# EAGLE design nadajnik (EAGLE 6.4)
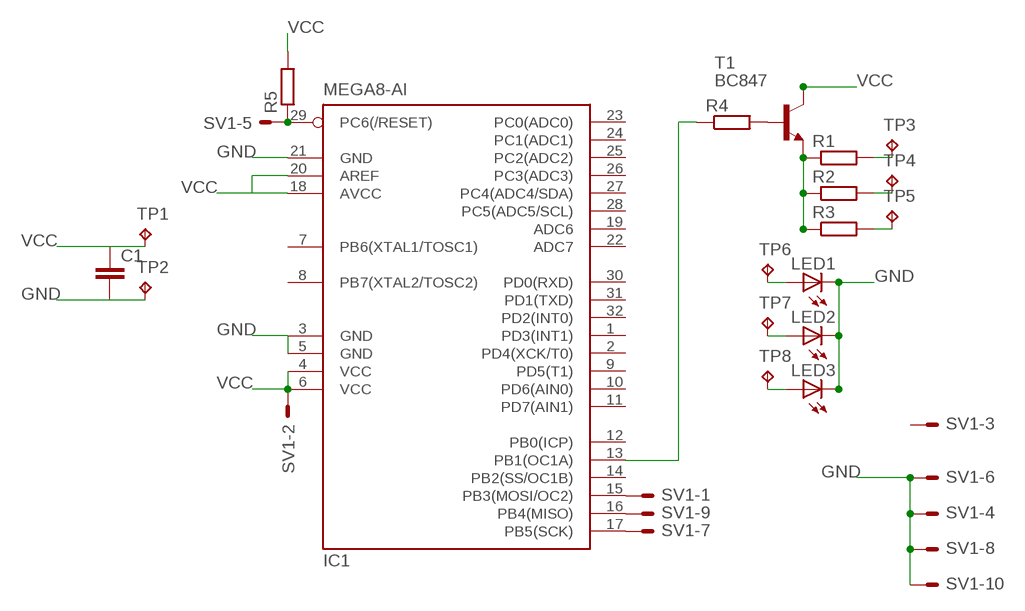
[diagram p0: schematic, sheet 1]

## Parts
C1  C-EUC1206  [C1206]
IC1  MEGA8-AI  [TQFP32-08]
LED1  LEDSFH480  [SFH480]
LED2  LEDSFH480  [SFH480]
LED3  LEDSFH480  [SFH480]
R1  R-EU_R1206  [R1206]
R2  R-EU_R1206  [R1206]
R3  R-EU_R1206  [R1206]
R4  R-EU_R1206  [R1206]
R5  R-EU_R1206  [R1206]
SV1  ML10E  [ML10]
T1  BC847  [SOT23]
TP1  TPPAD1-13Y  [P1-13Y]
TP2  TPPAD1-13Y  [P1-13Y]
TP3  TPPAD1-13Y  [P1-13Y]
TP4  TPPAD1-13Y  [P1-13Y]
TP5  TPPAD1-13Y  [P1-13Y]
TP6  TPPAD1-13Y  [P1-13Y]
TP7  TPPAD1-13Y  [P1-13Y]
TP8  TPPAD1-13Y  [P1-13Y]

## Nets
GND: C1.2 IC1.3(GND) IC1.5(GND) IC1.21(GND) LED1.K(C) LED2.K(C) LED3.K(C) SV1.4 SV1.6 SV1.8 SV1.10 TP2.TP
N$1: R1.2 TP3.TP
N$2: R2.2 TP4.TP
N$3: R3.2 TP5.TP
N$4: IC1.13(PB1(OC1A)) R4.1
N$5: R4.2 T1.1(B)
N$6: R1.1 R2.1 R3.1 T1.2(E)
N$7: LED1.A TP6.TP
N$8: LED2.A TP7.TP
N$9: LED3.A TP8.TP
N$10: IC1.15(PB3(MOSI/OC2)) SV1.1
N$11: IC1.29(PC6(/RESET)) R5.1 SV1.5
N$13: IC1.16(PB4(MISO)) SV1.9
N$14: IC1.17(PB5(SCK)) SV1.7
VCC: C1.1 IC1.4(VCC) IC1.6(VCC) IC1.18(AVCC) IC1.20(AREF) R5.2 SV1.2 T1.3(C) TP1.TP
Unconnected: IC1.1(PD3(INT1)) IC1.2(PD4(XCK/T0)) IC1.7(PB6(XTAL1/TOSC1)) IC1.8(PB7(XTAL2/TOSC2)) IC1.9(PD5(T1)) IC1.10(PD6(AIN0)) IC1.11(PD7(AIN1)) IC1.12(PB0(ICP)) IC1.14(PB2(SS/OC1B)) IC1.19(ADC6) IC1.22(ADC7) IC1.23(PC0(ADC0)) IC1.24(PC1(ADC1)) IC1.25(PC2(ADC2)) IC1.26(PC3(ADC3)) IC1.27(PC4(ADC4/SDA)) IC1.28(PC5(ADC5/SCL)) IC1.30(PD0(RXD)) IC1.31(PD1(TXD)) IC1.32(PD2(INT0)) SV1.3

## Library data of the parts
C1 = rcl:C-EU: CAPACITOR, European symbol
IC1 = atmel:MEGA8: MICROCONTROLLER 8 Kbytes FLASH, 1 kbytes SRAM, 512 bytes EEPROM, USART, 6-channel 10 bit ADC, 2-channel 8 bit ADC Pin compatible with Atmega48, ATMega88, ATMega168 Source: avr.lbr; MPN: ATMEGA8-16AU; OC_FARNELL: 9171371; OC_NEWARK: 73M8863
LED1-LED3 = led:LED: LED OSRAM: - CHIPLED LG R971, LG N971, LY N971, LG Q971, LY Q971, LO R971, LY R971 LH N974, LH R974 LS Q976, LO Q976, LY Q976 LO Q996 - Hyper CHIPLED LW Q18S LB Q993, LB Q99A, LB R99A - SideLED LS A670, LO A670, LY A670, LG A670, LP A670 LB A673, LV A673, LT A673, LW A673 LH A674 LY A675 LS A676, LA A676, LO A676, LY A676, LW A676 LS A679, LY A679, LG A679 - Hyper Micro SIDELED® LS Y876, LA Y876, LO Y876, LY Y876 LT Y87S - SmartLED LW L88C, LW L88S LB L89C, LB L89S, LG L890 LS L89K, LO L89K, LY L89K LS L896, LA L896, LO L896, LY L896 - TOPLED LS T670, LO T670, LY T670, LG T670, LP T670 LSG T670, LSP T670, LSY T670, LOP T670, LYG T670 LG T671, LOG T671, LSG T671 LB T673, LV T673, LT T673, LW T673 LH T674 LS T676, LA T676, LO T676, LY T676, LB T676, LH T676, LSB T676, LW T676 LB T67C, LV T67C, LT T67C, LS T67K, LO T67K, LY T67K, LW E67C LS E67B, LA E67B, LO E67B, LY E67B, LB E67C, LV E67C, LT E67C LW T67C LS T679, LY T679, LG T679 LS T770, LO T770, LY T770, LG T770, LP T770 LB T773, LV T773, LT T773, LW T773 LH T774 LS E675, LA E675, LY E675, LS T675 LS T776, LA T776, LO T776, LY T776, LB T776 LHGB T686 LT T68C, LB T68C - Hyper Mini TOPLED® LB M676 - Mini TOPLED Santana® LG M470 LS M47K, LO M47K, LY M47K Source: http://www.osram.convergy.de LUXEON: - LUMILED® LXK2-PW12-R00, LXK2-PW12-S00, LXK2-PW14-U00, LXK2-PW14-V00 LXK2-PM12-R00, LXK2-PM12-S00, LXK2-PM14-U00 LXK2-PE12-Q00, LXK2-PE12-R00, LXK2-PE12-S00, LXK2-PE14-T00, LXK2-PE14-U00 LXK2-PB12-K00, LXK2-PB12-L00, LXK2-PB12-M00, LXK2-PB14-N00, LXK2-PB14-P00, LXK2-PB14-Q00 LXK2-PR12-L00, LXK2-PR12-M00, LXK2-PR14-Q00, LXK2-PR14-R00 LXK2-PD12-Q00, LXK2-PD12-R00, LXK2-PD12-S00 LXK2-PH12-R00, LXK2-PH12-S00 LXK2-PL12-P00, LXK2-PL12-Q00, LXK2-PL12-R00 Source: www.luxeon.com KINGBRIGHT: KA-3528ASYC Source: www.kingbright.com
R1-R3 = resistor:R-EU_: RESISTOR, European symbol
R4 R5 = rcl:R-EU_: RESISTOR, European symbol
SV1 = con-ml:ML10E: HARTING; OC_FARNELL: unknown; OC_NEWARK: unknown
T1 = transistor:BC847: NPN TRANSISTOR
TP1-TP8 = testpad:TP: Test pad

## Board
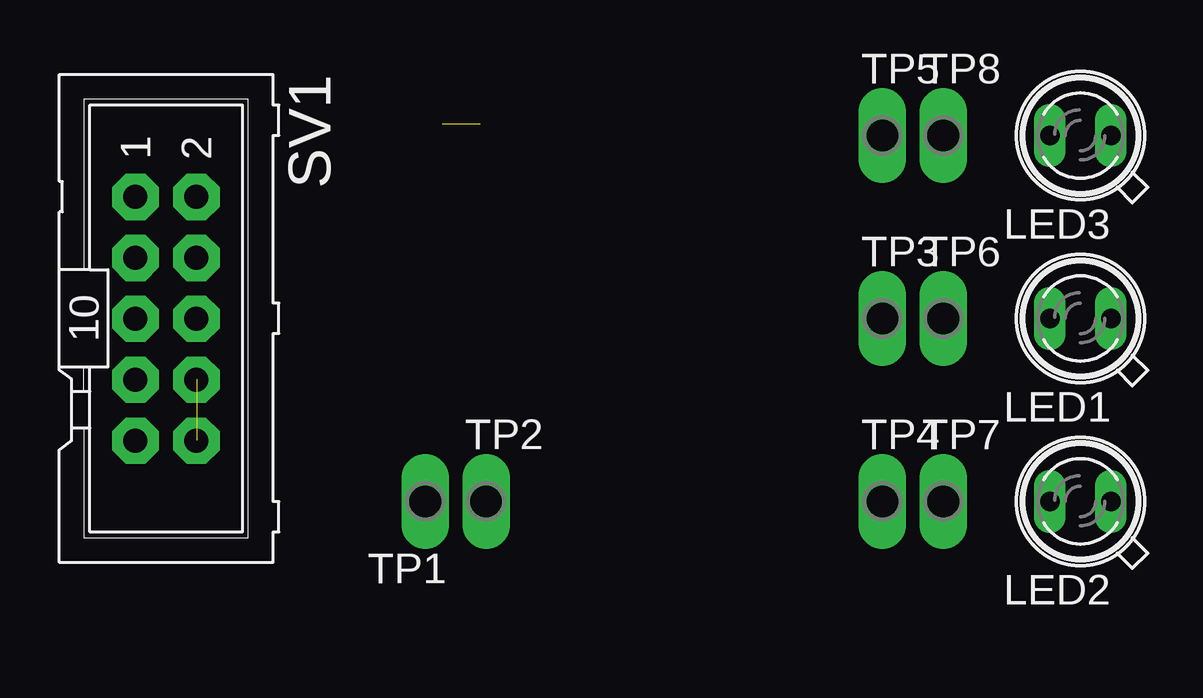
[diagram p1: board, top side]
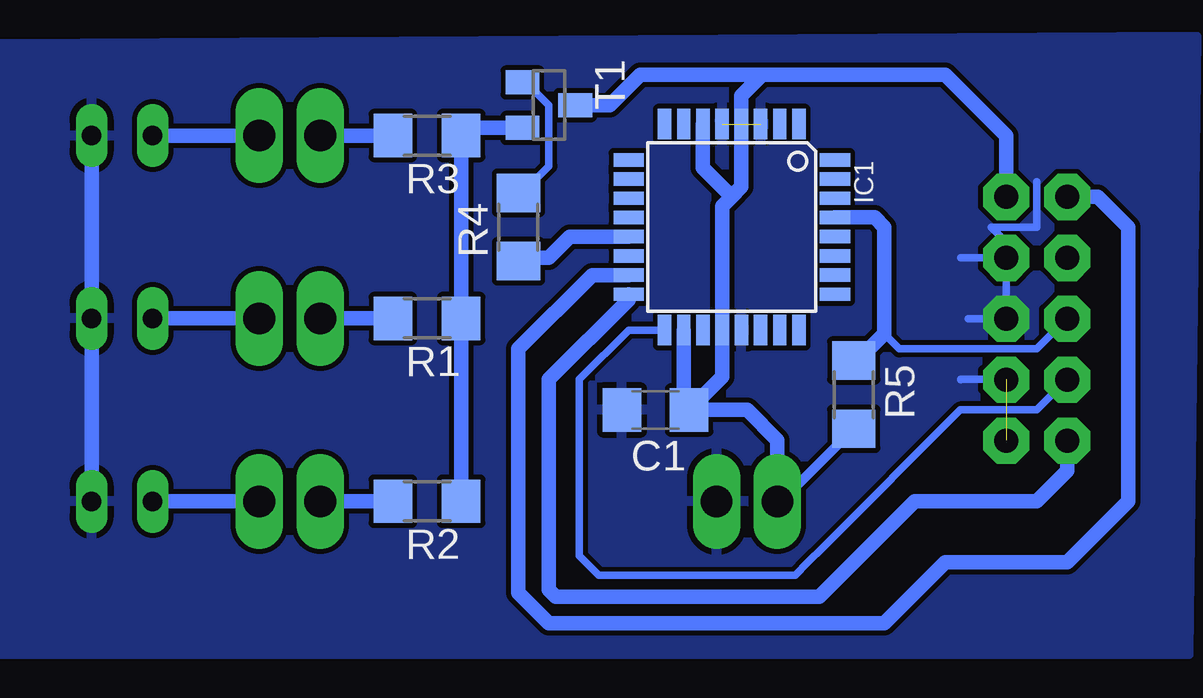
[diagram p2: board, bottom side, seen from below]

No outline drawn. Coordinates in mm, seen from the top.
Copper layers (1*16): Top 0.035mm / dielectric 1.5mm / Bottom 0.035mm
Design rules "default": minimum track width 10mil, minimum drill 24mil, track to track 8mil, track to pad 8mil, pad to pad 8mil, via to via 8mil, smd to smd 8mil, copper to edge 40mil, drill to drill 8mil, minimum pad ring 10mil, minimum via ring 8mil, stop-mask expansion 4mil, vias tented up to drill 0mil, thermal gap 10mil

### Footprints (pad centres in the part's own frame; a part is rotated, then mirrored left to right if it is on the bottom)
C1206 = smd 1.6 x 1.8: 1 -1.4,0; 2 1.4,0
TQFP32-08 = smd 1.27 x 0.559: 1 -4.293,2.8; 2 -4.293,2; 3 -4.293,1.2; 4 -4.293,0.4; 5 -4.293,-0.4; 6 -4.293,-1.2; 7 -4.293,-2; 8 -4.293,-2.8; 17 4.293,-2.8; 18 4.293,-2; 19 4.293,-1.2; 20 4.293,-0.4; 21 4.293,0.4; 22 4.293,1.2; 23 4.293,2; 24 4.293,2.8 | smd 0.559 x 1.27: 9 -2.8,-4.293; 10 -2,-4.293; 11 -1.2,-4.293; 12 -0.4,-4.293; 13 0.4,-4.293; 14 1.2,-4.293; 15 2,-4.293; 16 2.8,-4.293; 25 2.8,4.293; 26 2,4.293; 27 1.2,4.293; 28 0.4,4.293; 29 -0.4,4.293; 30 -1.2,4.293; 31 -2,4.293; 32 -2.8,4.293
SFH480 = drill 0.813 long: A 1.27,0; K -1.27,0
R1206 = smd 1.6 x 1.803: 1 -1.422,0; 2 1.422,0
ML10 = drill 0.914 octagon: 1 -5.08,-1.27; 2 -5.08,1.27; 3 -2.54,-1.27; 4 -2.54,1.27; 5 0,-1.27; 6 0,1.27; 7 2.54,-1.27; 8 2.54,1.27; 9 5.08,-1.27; 10 5.08,1.27
SOT23 = smd 1 x 1.4: 1 -0.95,-1.1; 2 0.95,-1.1; 3 0,1.1
P1-13Y = drill 1.321 pad 1.905 long: TP 0,0

### Placement (x,y rotation side)
C1  38.73,43.18 180 bottom
IC1  35.56,50.8 270 bottom
LED1  60.96,46.99 180 top
LED2  60.96,39.37 180 top
LED3  60.96,54.61 180 top
R1  48.26,46.99 180 bottom
R2  48.26,39.37 180 bottom
R3  48.26,54.61 180 bottom
R4  44.45,50.8 90 bottom
R5  30.48,43.81 270 bottom
SV1  22.86,46.99 270 top
T1  43.18,55.88 270 bottom
TP1  33.66,39.37 180 top
TP2  36.2,39.37 0 top
TP3  52.7,46.99 0 top
TP4  52.7,39.37 0 top
TP5  52.7,54.61 0 top
TP6  55.24,46.99 0 top
TP7  55.24,39.37 0 top
TP8  55.24,54.61 0 top

### Tracks (layer width: path | path; a pad name or v marks a point on that pad's centre or on a via)
GND  (via drill 1 pad 1.93)  (2 unrouted)
  Bottom 0.305: 22.85,52.69 22.85,50.78 24.76,50.78 24.13,50.16 SV1.4 | SV1.4 SV1.6 | SV1.4 26.03,49.53 26.03,49.51 | SV1.8 26.01,44.45 26.03,44.44 | v24.12,46.98 25.71,46.98
  Bottom 0.61: LED3.K LED1.K LED2.K
  pour Bottom (isolate 0.051): 16.19,58.74 66.04,58.42 66.04,33.02 16.51,33.02
N$1
  Bottom 0.61: R1.2 TP3.TP
N$2
  Bottom 0.61: R2.2 TP4.TP
N$3
  Bottom 0.61: R3.2 TP5.TP
N$4
  Bottom 0.61: IC1.13 42.31,50.4 43.18,49.53 44.3,49.53 R4.1
N$5
  Bottom 0.305: T1.1 44.13,56.83 43.18,55.88 43.18,53.34 44.3,52.22 R4.2
N$6
  Bottom 0.61: R2.1 R1.1 R3.1 46.52,54.93 T1.2
N$7
  Bottom 0.61: TP6.TP LED1.A
N$8
  Bottom 0.61: TP7.TP LED2.A
N$9
  Bottom 0.61: TP8.TP LED3.A
N$10
  Bottom 0.61: IC1.15 41.37,48.8 44.45,45.72 44.45,40.64 44.45,40.01 44.45,35.56 43.18,34.29 29.21,34.29 26.67,36.83 21.59,36.83 19.05,39.37 19.05,50.8 20.32,52.07 SV1.1
N$11
  Bottom 0.305: SV1.5 22.86,45.72 28.57,45.72 29.21,46.35
  Bottom 0.61: IC1.29 29.61,51.2 29.21,50.8 29.21,46.35 30.33,45.24 R5.1
N$12  (via drill 1 pad 1.93)
  other vias: 21.58,52.05
N$13
  Bottom 0.61: SV1.9 21.59,40.64 22.86,39.37 27.94,39.37 31.91,35.4 42.9,35.4 43.18,35.68 43.18,44.45 39.85,47.78 IC1.16
N$14
  Bottom 0.305: SV1.7 22.86,43.18 26.04,43.18 31.76,37.46 32.38,36.83 32.91,36.3 41.1,36.3 41.91,37.11 41.91,44.45 39.85,46.51 IC1.17
N$15  (via drill 1 pad 1.93)
  other vias: 24.12,52.05
N$16  (via drill 1 pad 1.93)
  other vias: 24.12,49.51
N$17  (via drill 1 pad 1.93)
  other vias: 21.58,49.51
N$18  (via drill 1 pad 1.93)
  other vias: 21.58,46.98
N$20  (via drill 1 pad 1.93)
  other vias: 21.58,44.44
N$21  (via drill 1 pad 1.93)
  other vias: 24.12,44.44
N$22  (via drill 1 pad 1.93)
  other vias: 24.12,41.9
N$23  (via drill 1 pad 1.93)
  other vias: 21.58,41.9
VCC
  Bottom 0.406: TP1.TP 33.5,39.37 R5.2
  Bottom 0.61: 34.29,57.15 35.16,56.28 IC1.4 35.16,52.47 35.56,52.07 | 34.29,57.15 26.67,57.15 24.13,54.61 SV1.2 | IC1.6 36.76,53.27 35.56,52.07 | 35.56,52.07 35.96,51.67 IC1.20 35.96,44.55 C1.1 | T1.3 40.64,55.88 39.37,57.15 34.29,57.15 | IC1.18 37.56,43.41 C1.1 | C1.1 34.92,43.18 33.66,41.91 TP1.TP